# EAGLE design D8035E_pcb_b.v1 (EAGLE 5.07)
LICENSE: CC-0; URL1: http://DangerousPrototypes.com
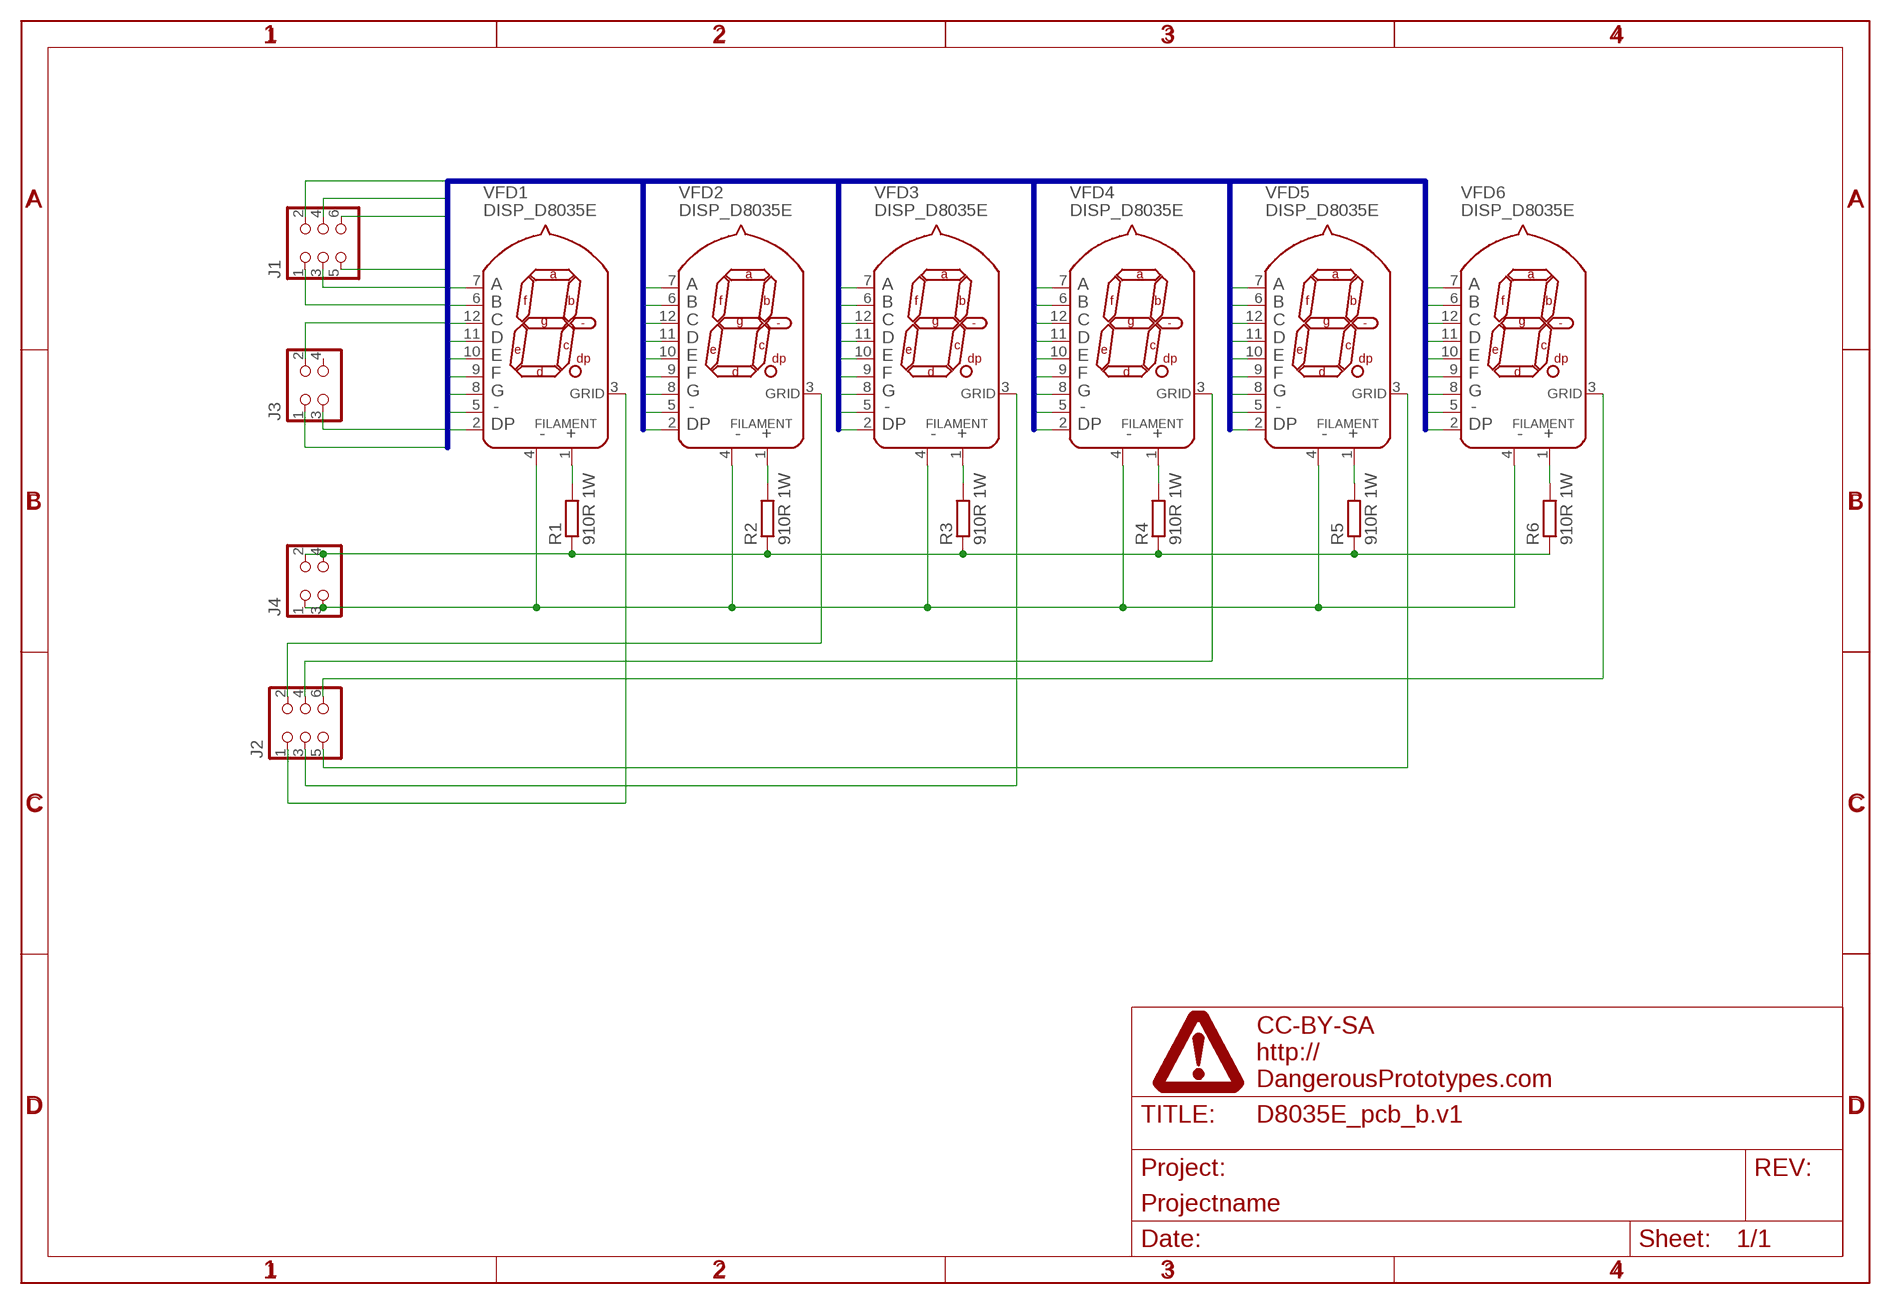
[diagram p0: schematic, sheet 1]

## Parts
J1  CON_HEADER_2X03-PTH  [M2X3]
J2  CON_HEADER_2X03-PTH  [M2X3]
J3  CON_HEADER_2X02-PTH  [M2X2]
J4  CON_HEADER_2X02-PTH  [M2X2]
R1  910R 1W  RESISTOR-PTH-0.4  [RTH025W]
R2  910R 1W  RESISTOR-PTH-0.4  [RTH025W]
R3  910R 1W  RESISTOR-PTH-0.4  [RTH025W]
R4  910R 1W  RESISTOR-PTH-0.4  [RTH025W]
R5  910R 1W  RESISTOR-PTH-0.4  [RTH025W]
R6  910R 1W  RESISTOR-PTH-0.4  [RTH025W]
U$1  FRAME_DINA4_L  [DP_LOGO]
VFD1  DISP_D8035E  [DISP_D8035E]
VFD2  DISP_D8035E  [DISP_D8035E]
VFD3  DISP_D8035E  [DISP_D8035E]
VFD4  DISP_D8035E  [DISP_D8035E]
VFD5  DISP_D8035E  [DISP_D8035E]
VFD6  DISP_D8035E  [DISP_D8035E]

## Nets
-: J3.2 VFD1.5(-) VFD2.5(-) VFD3.5(-) VFD4.5(-) VFD5.5(-) VFD6.5(-)
A: J1.1 VFD1.7(A) VFD2.7(A) VFD3.7(A) VFD4.7(A) VFD5.7(A) VFD6.7(A)
B: J1.2 VFD1.6(B) VFD2.6(B) VFD3.6(B) VFD4.6(B) VFD5.6(B) VFD6.6(B)
C: J1.3 VFD1.12(C) VFD2.12(C) VFD3.12(C) VFD4.12(C) VFD5.12(C) VFD6.12(C)
D: J1.4 VFD1.11(D) VFD2.11(D) VFD3.11(D) VFD4.11(D) VFD5.11(D) VFD6.11(D)
DP: J3.3 VFD1.2(DP) VFD2.2(DP) VFD3.2(DP) VFD4.2(DP) VFD5.2(DP) VFD6.2(DP)
E: J1.5 VFD1.10(E) VFD2.10(E) VFD3.10(E) VFD4.10(E) VFD5.10(E) VFD6.10(E)
F: J1.6 VFD1.9(F) VFD2.9(F) VFD3.9(F) VFD4.9(F) VFD5.9(F) VFD6.9(F)
FIL+: J4.2 J4.4 R1.1 R2.1 R3.1 R4.1 R5.1 R6.1
FIL-: J4.1 J4.3 VFD1.4(F-) VFD2.4(F-) VFD3.4(F-) VFD4.4(F-) VFD5.4(F-) VFD6.4(F-)
G: J3.1 VFD1.8(G) VFD2.8(G) VFD3.8(G) VFD4.8(G) VFD5.8(G) VFD6.8(G)
GR1: J2.1 VFD1.3(GRID)
GR2: J2.2 VFD2.3(GRID)
GR3: J2.3 VFD3.3(GRID)
GR4: J2.4 VFD4.3(GRID)
GR5: J2.5 VFD5.3(GRID)
GR6: J2.6 VFD6.3(GRID)
N$1: R1.2 VFD1.1(F+)
N$2: R2.2 VFD2.1(F+)
N$3: R3.2 VFD3.1(F+)
N$4: R4.2 VFD4.1(F+)
N$5: R5.2 VFD5.1(F+)
N$6: R6.2 VFD6.1(F+)
Unconnected: J3.4

## Buses
A,B,C,D,E,F,G,-,DP

## Library data of the parts
J1 J2 = dp_devices:CON_HEADER_2X03
J3 J4 = dp_devices:CON_HEADER_2X02
R1-R6 = dp_devices:RESISTOR
U$1 = dp_devices:FRAME_DINA4_L: A4 DP frame Standard Dangerous Prototypes schematic frame. Automagically adds the DP logo and standard texts to the PCB Use the atrribute in the schematic editor to change the fields.; FF1: fulfillment by; FF2: Seeed Studio; FF3: www.seeedstudio.com; LICENSE: CC-BY-SA; PROJECT: Projectname; URL1: http://; URL2: DangerousPrototypes.com
VFD1-VFD6 = dp_devices:DISP_D8035E: VFD 7-Segment Display Mfr no: NEC LD8035E D-8035-E PDF <http://www.tube-tester.com/sites/nixie/dat_arch/D-8035-E_LD8035.pdf>

## Board
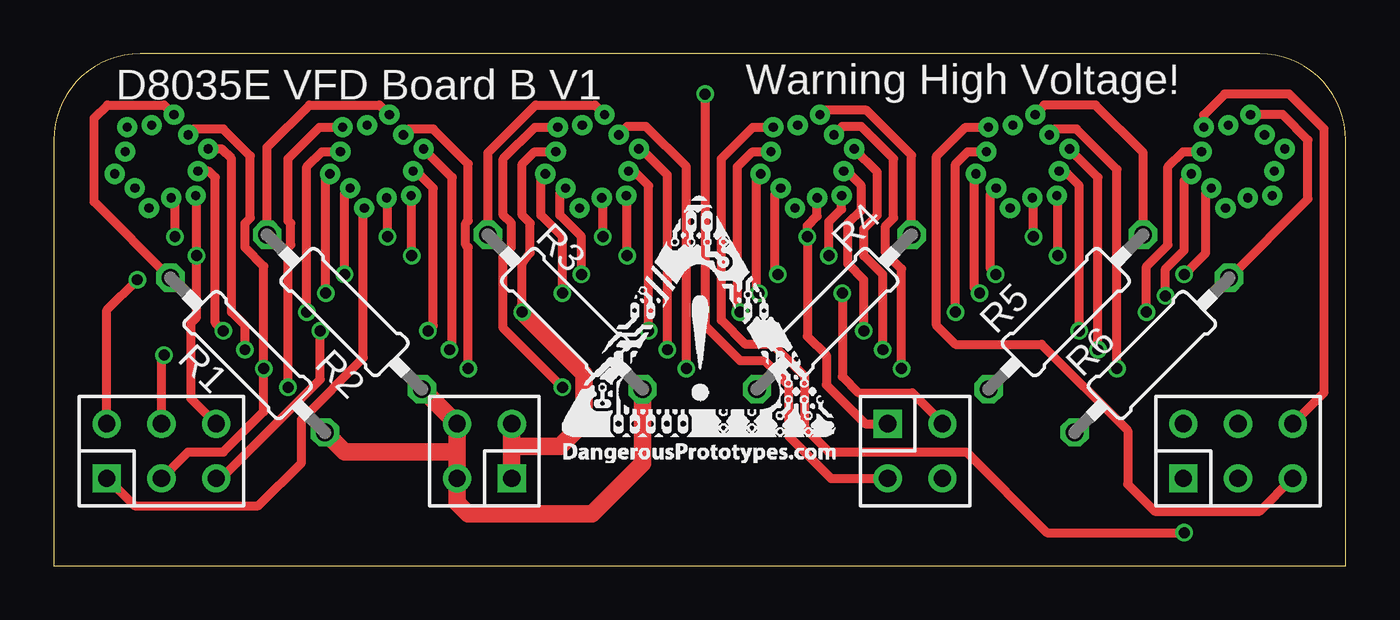
[diagram p1: board, top side]
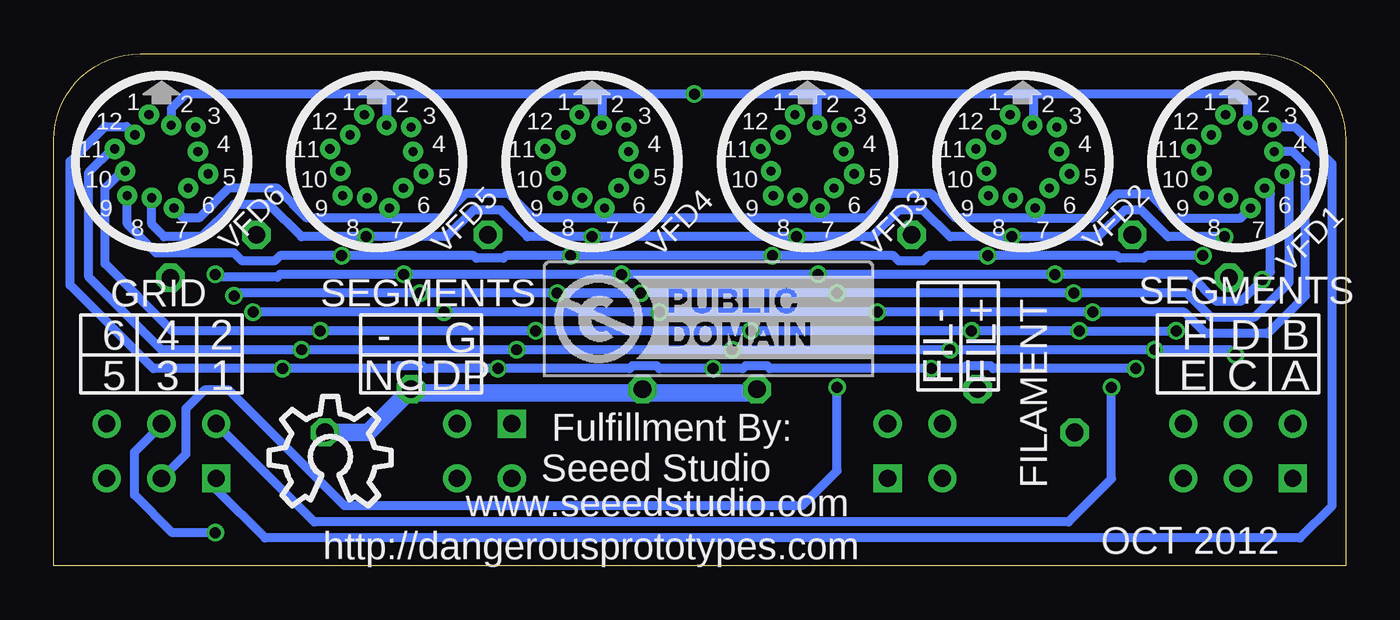
[diagram p2: board, bottom side, seen from below]

Size 60 x 23.79 mm. Coordinates in mm from the lower left corner, seen from the top.
Outline: 0,0 60,0 60,19.79 arc90 56,23.79 4,23.79 arc90 0,19.79 0,0
Copper layers (1*16): Top 0.035mm / dielectric 1.5mm / Bottom 0.035mm
Design rules "Fusion_eagle_rule_v1.1": minimum track width 6mil, minimum drill 12mil, track to track 6mil, track to pad 6mil, pad to pad 6mil, via to via 6mil, smd to smd 0mil, copper to edge 10mil, drill to drill 10mil, minimum pad ring 10mil, minimum via ring 6mil, stop-mask expansion 2mil, vias tented up to drill 100mil, thermal gap 10mil

### Footprints (pad centres in the part's own frame; a part is rotated, then mirrored left to right if it is on the bottom)
M2X3 = drill 0.8 square: 1 -2.54,-1.27 | drill 0.8 round: 2 -2.54,1.27; 3 0,-1.27; 4 0,1.27; 5 2.54,-1.27; 6 2.54,1.27
M2X2 = drill 0.8 square: 1 -1.27,-1.27 | drill 0.8 round: 2 -1.27,1.27; 3 1.27,-1.27; 4 1.27,1.27
RTH025W = drill 0.813 octagon: 1 -5.08,0; 2 5.08,0
DISP_D8035E = drill 0.43 round: 1 0.582,-2.173; 2 -0.453,-1.69; 3 -1.591,-1.591; 4 -1.69,-0.453; 5 -2.173,0.582; 6 -1.237,1.237; 7 -0.582,2.173; 8 0.453,1.69; 9 1.591,1.591; 10 1.69,0.453; 11 2.173,-0.582; 12 1.237,-1.237

### Placement (x,y rotation side)
J1  5,5.33 0 top
J2  55,5.33 0 top
J3  40,5.33 270 top
J4  20,5.33 90 top
R1  9,9.79 135 top
R2  13.5,11.79 135 top
R3  23.75,11.79 135 top
R4  36.25,11.79 45 top
R5  47,11.79 45 top
R6  51,9.79 45 top
U$1  0.87,-5.27 0 top  (outside the outline)
U$2  [DP_LOGO_ART_0.5X0.5]  23.62,4.79 0 top
U$3  [LOGO_CC-0]  37.25,8.79 0 bottom
U$4  [OSHW_10X200_NOTEXT]  50,2.79 0 bottom
VFD1  5,18.79 180 bottom
VFD2  15,18.79 180 bottom
VFD3  25,18.79 180 bottom
VFD4  35,18.79 180 bottom
VFD5  45,18.79 180 bottom
VFD6  55,18.79 180 bottom

### Tracks (layer width: path | path; a pad name or v marks a point on that pad's centre or on a via)
-  (via drill 0.51)
  Top 0.406: v12.62,12.66 12.62,18.01 VFD2.5 | 22.75,18.13 VFD3.5 22.62,18.01 22.62,16.29 23.62,15.29 v23.62,12.66 | v32.75,12.66 32.62,12.79 32.62,18.01 VFD4.5 | VFD5.5 42.79,18.21 42.75,18.16 42.75,12.91 v43,12.66 | J3.2 41.27,6.64 39.88,8.04 37.38,8.04 36.62,8.79 v36.62,12.66 | 52.62,18.04 52.79,18.21 VFD6.5 52.5,17.88 52.5,14.66 51.62,13.79 v51.62,12.54
  Bottom 0.406: v36.62,12.66 v23.62,12.66 v12.62,12.66 7.38,12.66 6.25,11.54 4.25,11.54 2.62,13.16 2.62,18.01 VFD1.5 | v36.62,12.66 v43,12.66 51.5,12.66 v51.62,12.54 | v36.62,12.66 v32.75,12.66
A
  Top 0.406: J1.1 2.48,4.06 3.75,2.79 9.5,2.79 11.5,4.79 11.5,6.79 14.38,9.66 14.38,16.57 VFD2.7
  Bottom 0.406: 14.5,16.16 11.75,16.16 10.62,17.29 9.12,17.29 8,16.16 4.87,16.16 VFD1.7 | 24.5,16.16 34.38,16.16 | VFD2.7 14.42,16.25 14.5,16.16 | VFD3.7 24.42,16.25 24.5,16.16 | VFD4.7 34.42,16.21 34.38,16.16 | VFD5.7 44.42,16.25 44.5,16.16 | VFD6.7 53.97,16.16 53.25,16.16 51.88,17.54 49.62,17.54 48.25,16.16 44.5,16.16 | 34.38,16.16 37.75,16.16 38.88,17.29 40.88,17.29 42,16.16 44.5,16.16 | 14.5,16.16 18.12,16.16 19.25,17.29 21.12,17.29 22.25,16.16 24.5,16.16
B  (via drill 0.51)
  Top 0.406: v13.5,13.54 13.5,17.29 VFD2.6 | v33.62,13.54 33.5,13.66 33.5,17.29 VFD4.6 | VFD5.6 43.5,17.29 43.5,13.79 v43.75,13.54 | VFD6.6 53.5,17.29 53.5,14.54 v52.5,13.54 | J1.2 2.46,11.88 v3.88,13.29 | VFD3.6 23.5,17.29 23.5,16.29 24.5,15.29 v24.5,13.54
  Bottom 0.406: VFD1.6 3.5,17.29 3.5,13.66 v3.88,13.29 4.88,12.29 6,12.29 7.25,13.54 v13.5,13.54 v24.5,13.54 v33.62,13.54 v43.75,13.54 49.5,13.54 49.62,13.41 52.38,13.41 v52.5,13.54
C  (via drill 0.51)
  Top 0.406: VFD1.12 6.5,20.29 7.88,20.29 9.12,19.04 9.12,16.16 8.88,15.91 8.88,14.79 9.75,13.91 v9.75,9.16 9.75,7.17 7.88,5.29 6.23,5.29 J1.3 | VFD2.12 16.5,20.29 17.62,20.29 19.25,18.66 19.25,16.04 19.12,15.91 19.12,14.91 19.25,14.79 v19.25,9.16 | VFD3.12 26.62,20.41 27.5,20.41 29.38,18.54 v29.38,9.16 | VFD4.12 36.62,20.41 37.5,20.41 39,18.91 39,16.16 38.62,15.79 38.62,14.54 39.38,13.79 v39.38,9.16 | VFD5.12 46.5,20.29 47.5,20.29 49.38,18.41 v49.38,9.16
  Bottom 0.406: v9.75,9.16 16.38,9.16 16.5,9.29 17.62,9.29 17.75,9.16 v19.25,9.16 26.75,9.16 26.88,9.29 27.88,9.29 28,9.16 v29.38,9.16 31.88,9.16 32,9.29 33.12,9.29 33.25,9.16 v39.38,9.16 42.75,9.16 42.88,9.29 44,9.29 44.12,9.16 v49.38,9.16 55.38,9.16 59.25,13.04 59.25,18.79 57.62,20.41 56.62,20.41 VFD6.12
D  (via drill 0.51)
  Top 0.406: VFD1.11 7.79,19.37 8.25,18.91 8.25,11.79 8.88,11.16 v8.88,10.04 | VFD2.11 18.5,18.04 18.5,10.16 v18.38,10.04 | J1.4 5,9.66 v5.12,9.79 | VFD3.11 27.29,19.37 28.5,18.16 v28.5,10.04 | VFD4.11 38.25,18.29 38.25,16.29 37.62,15.66 37.62,14.41 38.5,13.54 v38.5,10.04 | VFD5.11 48.5,18.04 v48.5,10.04
  Bottom 0.406: v5.12,9.79 5.25,9.91 5.38,10.04 v8.88,10.04 v18.38,10.04 v28.5,10.04 v38.5,10.04 v48.5,10.04 55,10.04 58.38,13.41 58.38,18.29 57.29,19.37 VFD6.11
DP  (via drill 0.51)
  Top 0.406: J3.3 36.1,4.06 34.12,6.04 34.12,8.41 33,9.54 31.88,9.54 30.25,11.16 v30.25,21.91
  Bottom 0.406: 34.5,21.91 v30.25,21.91 24.5,21.91 | 34.5,21.91 44.62,21.91 | 14.5,21.91 5,21.91 4.55,21.46 VFD1.2 | 14.5,21.91 24.5,21.91 | VFD2.2 14.55,20.49 14.5,20.54 14.5,21.91 | VFD3.2 24.55,21.87 24.5,21.91 | VFD4.2 34.55,21.87 34.5,21.91 | VFD5.2 44.55,21.84 44.62,21.91 | VFD6.2 54.55,21.24 53.88,21.91 44.62,21.91
E  (via drill 0.51)
  Top 0.406: VFD1.10 7.2,18.34 7.5,18.04 7.5,11.29 v7.88,10.91 | VFD2.10 16.83,18.34 17.62,17.54 17.62,11.16 v17.38,10.91 | VFD3.10 26.95,18.34 27.62,17.66 v27.62,10.91 | VFD4.10 36.83,18.34 37.5,17.66 37.5,16.54 36.88,15.91 36.88,14.04 37.62,13.29 v37.62,10.91 | VFD5.10 46.95,18.34 47.62,17.66 v47.62,10.91 | v12.38,10.91 12.38,8.66 7.77,4.06 J1.5
  Bottom 0.406: v7.88,10.91 v12.38,10.91 v17.38,10.91 v27.62,10.91 v37.62,10.91 v47.62,10.91 54.5,10.91 57.62,14.04 57.62,17.54 56.83,18.34 VFD6.10
F  (via drill 0.51)
  Top 0.406: VFD1.9 6.62,17.16 v6.62,14.41 6.62,11.54 6.38,11.29 6.38,7.76 J1.6 | v16.62,14.41 16.62,17.16 VFD2.9 | v26.62,14.41 26.62,17.16 VFD3.9 | v46.62,14.41 46.62,17.16 VFD5.9 | VFD4.9 36.59,16.57 36,15.98 v36,14.41
  Bottom 0.406: v6.62,14.41 9.25,14.41 9.38,14.29 10.5,14.29 10.62,14.41 v16.62,14.41 19.38,14.41 19.62,14.16 20.75,14.16 21,14.41 v26.62,14.41 v36,14.41 39,14.41 39.12,14.29 40.38,14.29 40.5,14.41 v46.62,14.41 49.5,14.41 49.75,14.16 51.25,14.16 51.62,14.54 55.25,14.54 56.59,15.88 VFD6.9
FIL+
  Top 0.813: 18.73,5.29 J4.2 18.73,2.94 19.25,2.42 25,2.42 27.34,4.76 R3.1 | 18.73,5.29 J4.4 17.13,8.2 R2.1 | R1.1 | R1.1 13.5,5.29 18.73,5.29 | R3.1
  Bottom 0.813: R6.1 45.41,6.2 R5.1 43.25,8.04 32.62,8.04 | R3.1 | R3.1 27.5,8.04 32.62,8.04 | R4.1 32.66,8.07 32.62,8.04
FIL-  (via drill 0.51)
  Top 0.406: J4.3 21.27,6.69 | v11.75,11.79 11.75,18.54 12.45,19.24 VFD2.4 | VFD3.4 22.33,19.24 21.75,18.66 21.75,16.29 22.12,15.91 22.12,14.54 21.75,14.04 v21.75,11.79 | v31.88,11.79 31.75,11.91 31.75,18.54 32.45,19.24 VFD4.4 | VFD5.4 42.45,19.24 41.88,18.66 v41.88,11.79 | VFD6.4 52.45,19.24 51.75,18.54 51.75,14.91 50.75,13.91 v50.75,11.79
  Top 0.813: 21.27,5.54 J4.1 | 21.27,5.54 J4.3 | v21.75,11.79 24.62,8.91 24.62,6.67 23.5,5.54 21.27,5.54
  Bottom 0.406: v50.75,11.79 v41.88,11.79 v31.88,11.79 v21.75,11.79 v11.75,11.79 7.5,11.79 6.5,10.79 3.62,10.79 1.88,12.54 1.88,18.66 2.45,19.24 VFD1.4
G  (via drill 0.51)
  Top 0.406: v5.62,15.29 5.62,16.93 VFD1.8 | v15.5,15.29 15.5,17.05 VFD2.8 | v25.5,15.29 25.5,17.05 VFD3.8 | v45.5,15.29 45.5,17.05 VFD5.8 | VFD4.8 35.45,16.24 35,15.79 v35,15.29 35,10.66 35.88,9.79 35.88,8.41 37.69,6.6 J3.1
  Bottom 0.406: v5.62,15.29 8.25,15.29 9.5,16.54 10.25,16.54 11.5,15.29 v15.5,15.29 18.38,15.29 19.62,16.54 20.75,16.54 22,15.29 v25.5,15.29 v35,15.29 38,15.29 39.25,16.54 40.5,16.54 41.75,15.29 v45.5,15.29 48.5,15.29 50,16.79 51.62,16.79 53.12,15.29 54.88,15.29 55.45,15.87 VFD6.8
GR1
  Bottom 0.406: VFD1.3 2.34,20.38 0.62,18.66 0.62,2.79 2.12,1.29 50.19,1.29 52.46,3.56 J2.1
GR2  (via drill 0.51)
  Top 0.406: VFD2.3 12.34,20.38 10.88,18.91 10.88,16.04 11,15.91 11,14.91 10.88,14.79 v10.88,8.29
  Bottom 0.406: v10.88,8.29 10.88,4.04 12.88,2.04 47.9,2.04 J2.2
GR3  (via drill 0.51)
  Top 0.406: VFD3.3 22.34,20.38 20.88,18.91 20.88,16.29 21.25,15.91 21.25,14.79 20.88,14.41 20.88,11.04 v23.62,8.29
  Bottom 0.406: J2.3 53.88,5.19 53.88,7.29 53,8.16 51.88,8.16 46.5,2.79 25.25,2.79 23.62,4.42 v23.62,8.29
GR4  (via drill 0.51)
  Top 0.406: VFD4.3 32.47,20.38 31,18.91 31,11.41 32.12,10.29 33.38,10.29 34.88,8.79 34.88,6.42 36,5.29 42.38,5.29 46.12,1.54 v52.5,1.54
  Bottom 0.406: J2.4 55,6.54 56.25,5.29 56.25,3.29 54.5,1.54 v52.5,1.54
GR5
  Top 0.406: VFD5.3 42.34,20.38 41,19.04 41,11.16 41.88,10.29 45.88,10.29 49.88,6.29 49.88,3.79 51.12,2.54 56,2.54 57.52,4.06 J2.5
GR6
  Top 0.406: VFD6.3 53.41,20.95 54.38,21.91 57.38,21.91 59,20.29 59,8.06 J2.6
N$1
  Top 0.406: VFD1.1 5.12,21.41 2.5,21.41 1.88,20.79 1.88,16.91 R1.2
N$2
  Top 0.406: VFD2.1 15.12,21.41 11.88,21.41 9.91,19.45 R2.2
N$3
  Top 0.406: VFD3.1 25.12,21.41 22.38,21.41 20.16,19.2 R3.2
N$4
  Top 0.406: VFD4.1 35.58,21 35.75,21.16 37.75,21.16 39.84,19.07 R4.2
N$5
  Top 0.406: VFD5.1 45.58,21 46,21.41 48.38,21.41 50.59,19.2 R5.2
N$6
  Top 0.406: VFD6.1 57.08,20.96 58.25,19.79 58.25,17.04 R6.2

### Text on the board
tPlace: D8035E VFD Board B V1 | Warning High Voltage!
bPlace: FILAMENT | SEGMENTS | SEGMENTS | GRID | B | D | F | G | - | 2 | 4 | 6 | FIL+ | FIL- | A | C | E | DP | NC | 1 | 3 | 5 | Fulfillment By: | Seeed Studio | www.seeedstudio.com | OCT 2012 | http://dangerousprototypes.com